# Altium project PCB_Project.PrjPcb
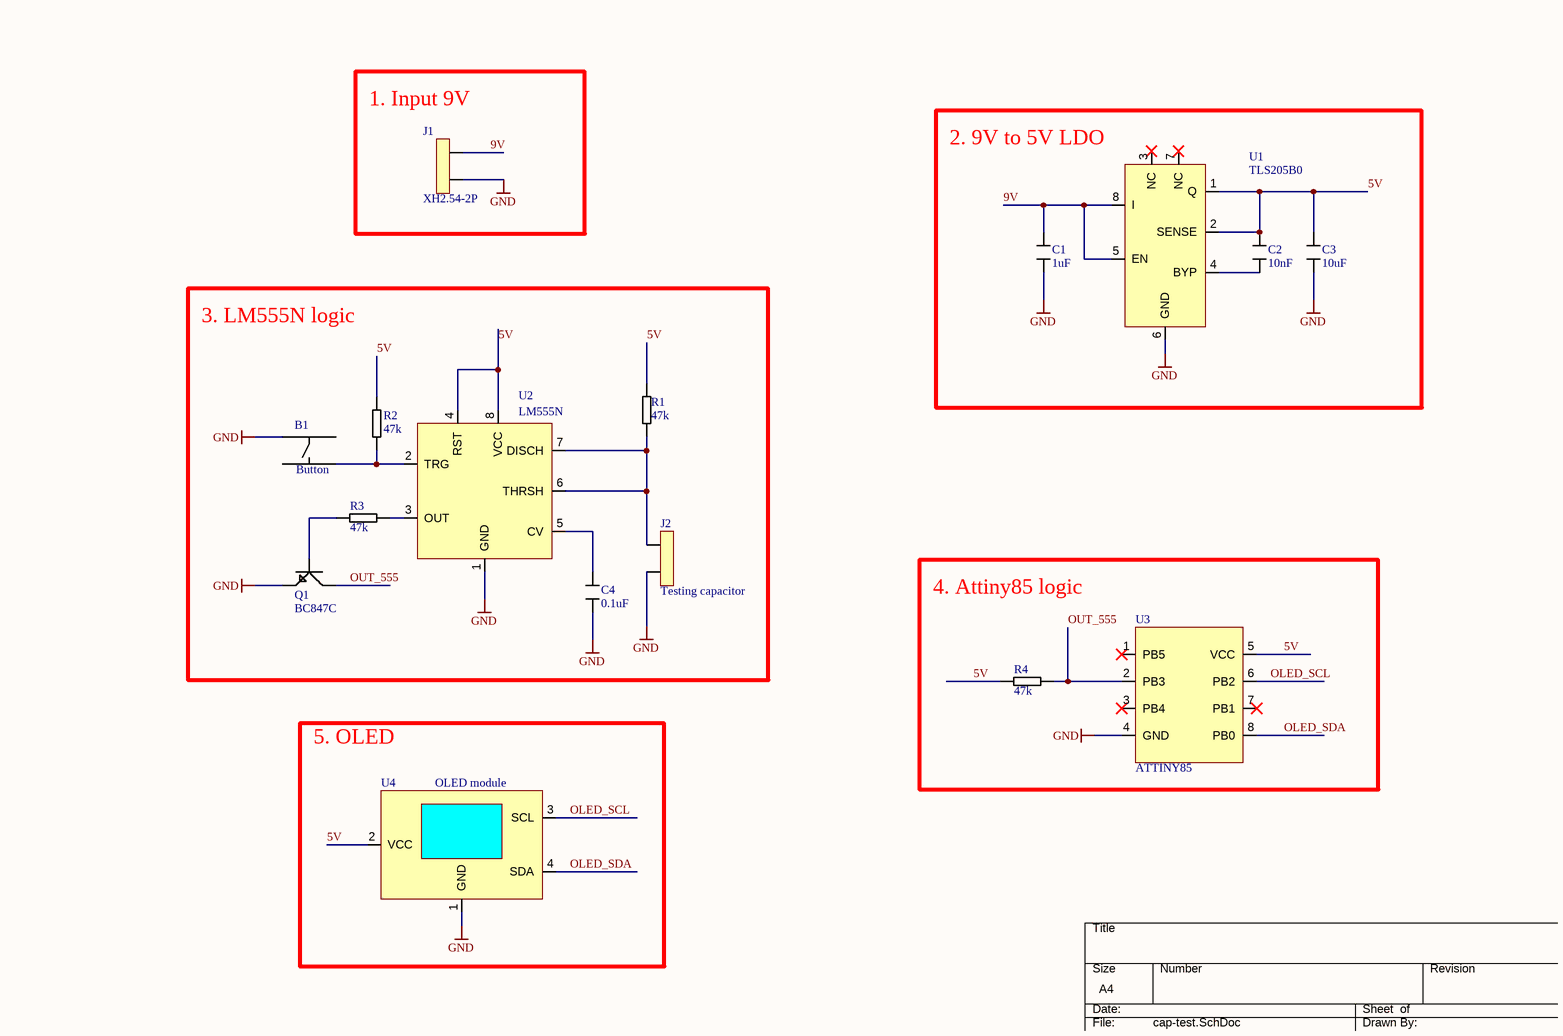
[diagram p0: cap-test.SchDoc]
1 sheet, 16 parts. Net scope: global (net labels, ports and power ports of the same name join across sheets).
Board file: cap-test.PcbDoc

## Sheet cap-test.SchDoc: Capacitor tester
size A4; Author: Liutauras Skamarakas; DrawnBy: Liutauras Skamarakas; DocumentNumber: 1; Revision: 1; SheetNumber: 1; SheetTotal: 1; ENG_APP_DATE: --/--/--; DSN_APP_DATE: --/--/--; CHK_APP_DATE: --/--/--

### Parts
B1  Button  [Button]
C1  1uF  [0603]
C2  10nF  [0603]
C3  10uF  [0603]
C4  0.1uF  [0603]
J1  XH2.54-2P  [XH2.54-2P]
J2  Testing capacitor  [2.54mm header]
Q1  BC847C  [BC847C]
R1  47k  [0603]
R2  47k  [0603]
R3  47k  [0603]
R4  47k  [0603]
U1  TLS205B0  [TLS205B0]
U2  LM555N  [DIP8]
U3  ATTINY85  [DIP8]
U4  OLED module  [OLED module]

### Blocks framed on the sheet
1. Input 9V: J1
2. 9V to 5V LDO: C1-C3 U1
3. LM555N logic: B1 C4 J2 Q1 R1-R3 U2
4. Attiny85 logic: R4 U3
5. OLED: U4

### Nets
GND: B1.1 C1.1 C3.1 C4.1 J1.2 J2.1 Q1.2 U1.6(GND) U2.1(GND) U3.4(GND) U4.1(GND)
5V: C2.2 C3.2 R1.1 R2.2 R4.1 U1.1(Q) U1.2(SENSE) U2.4(RST) U2.8(VCC) U3.5(VCC) U4.2(VCC)
9V: C1.2 J1.1 U1.5(EN) U1.8(I)
OLED_SCL: U3.6(PB2) U4.3(SCL)
OLED_SDA: U3.8(PB0) U4.4(SDA)
OUT_555: Q1.3 R4.2 U3.2(PB3)
NetB1_4: B1.4 R2.1 U2.2(TRG)
NetC2_1: C2.1 U1.4(BYP)
NetC4_2: C4.2 U2.5(CV)
NetJ2_2: J2.2 R1.2 U2.6(THRSH) U2.7(DISCH)
NetQ1_1: Q1.1 R3.1
NetR3_2: R3.2 U2.3(OUT)

Not connected (* = marked no-connect by the designer): B1 2 3; U1 3(NC)* 7(NC)*; U3 1(PB5)* 3(PB4)* 7(PB1)*

### Notes on the sheet
- DWG. NO.
- REV.
- SHT.
- THIS DOCUMENT AND THE DATA DISCLOSED HEREIN OR HEREWITH IS THE PROPERTY OF ALTIUM LIMITED AND MAY BE FREELY DISTRIBUTED IN WHOLE. NO RIGHTS ARE RESERVED OR EXPRESS OR IMPLIED WARANTEE GIVEN.
- REVISION
- DESCRIPTION
- DATE
- APPROVED
- ENG:
- APPROVALS
- PROJECT
- DSN:
- CHK:
- REFERENCE DOCUMENTS
- PROJECT REVISION:
- TITLE
- DOCUMENT REVISION:
- DESIGN ITEM:
- BOM:
- FAB DWG:
- PCB DWG:
- ASSY DWG:
- SCALE:
- SIZE
- B
- CAGE CODE
- FILE NAME
- DWG NO.
- SHEET
- OF
- REV

### Library data of the parts
B1 = Button: https://jlcpcb.com/partdetail/Yiyuan-YTS1R0032CBG00/C3001435
J2 = 2.54mm pin header female
Q1 = BC847C: https://jlcpcb.com/partdetail/Hongjiacheng-BC847C/C7420337
R1-R4 = 47k: https://jlcpcb.com/partdetail/Walsin_TechCorp-WR06X4702FTL/C146207
U1 = TLS205B0: https://wmsc.lcsc.com/wmsc/upload/file/pdf/v2/lcsc/2401161412_Infineon-Technologies-TLS205B0EJV50XUMA1_C3747247.pdf
U2 = LM555N: https://jlcpcb.com/partdetail/Hgsemi-LM555N/C725327
U3 = ATTINY85: https://jlcpcb.com/partdetail/MicrochipTech-ATTINY8520PU/C965497